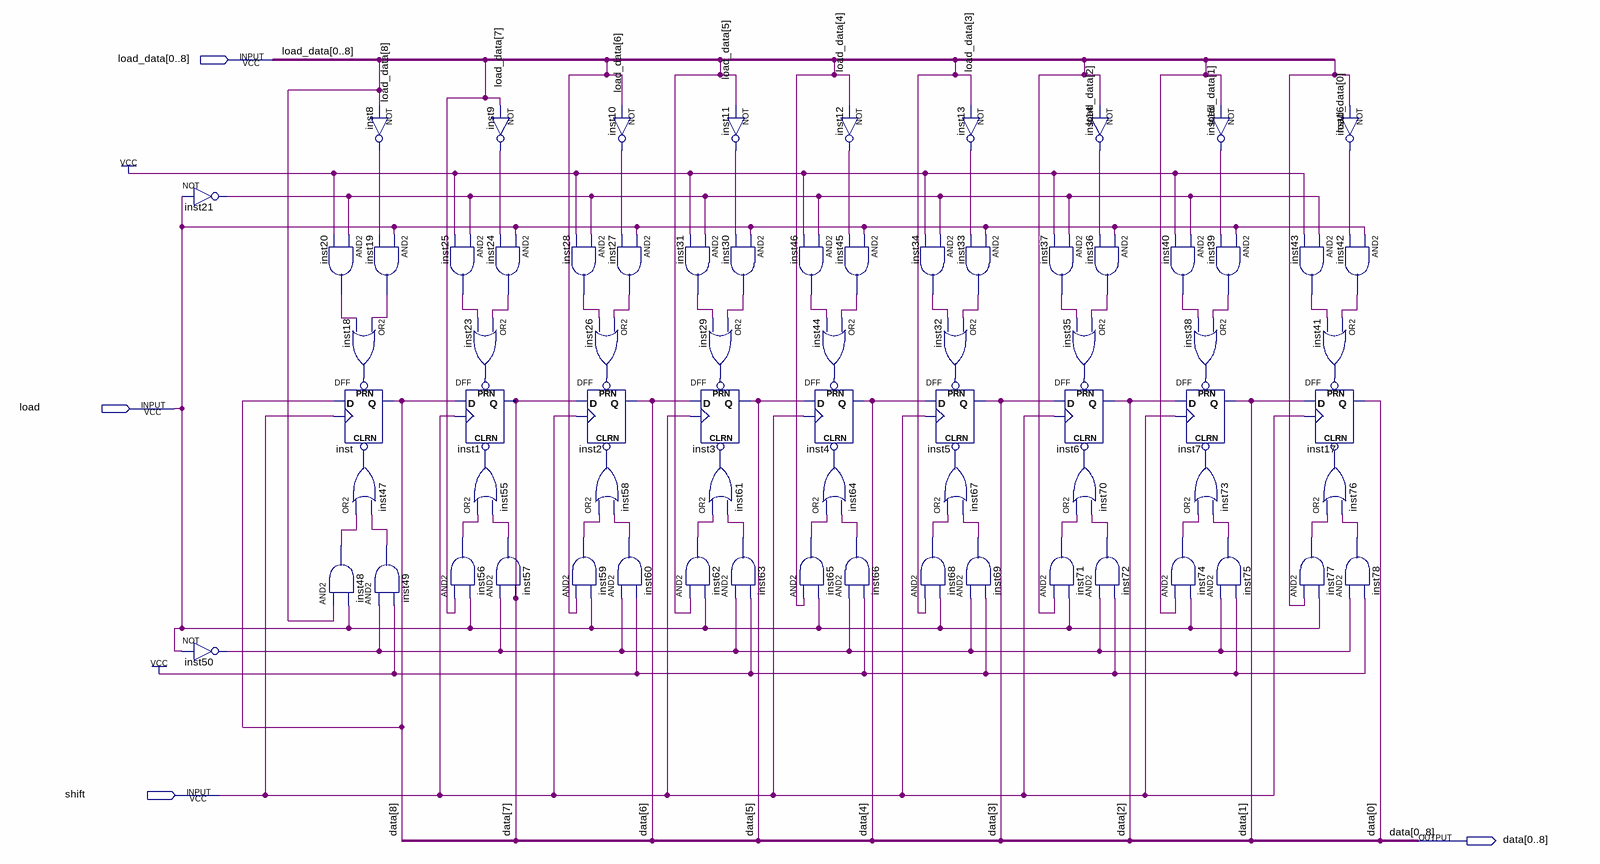
[diagram p0: schematic sheet]
// Quartus schematic p_register.bdf as structural Verilog: 74 symbols, 4 pins
module p_register (
  input  [0:8] load_data,
  input  load,
  input  shift,
  output [0:8] data
);

  wire inst8_out, inst9_out, inst10_out, inst11_out, inst12_out, inst13_out, inst14_out, inst15_out,
       inst16_out, inst18_out, inst19_out, inst20_out, inst21_out, inst23_out, inst24_out, inst25_out,
       inst26_out, inst27_out, inst28_out, inst29_out, inst30_out, inst31_out, inst32_out, inst33_out,
       inst34_out, inst35_out, inst36_out, inst37_out, inst38_out, inst39_out, inst40_out, inst41_out,
       inst42_out, inst43_out, inst44_out, inst45_out, inst46_out, inst47_out, inst48_out, inst49_out,
       inst50_out, inst55_out, inst56_out, inst57_out, inst58_out, inst59_out, inst60_out, inst61_out,
       inst62_out, inst63_out, inst64_out, inst65_out, inst66_out, inst67_out, inst68_out, inst69_out,
       inst70_out, inst71_out, inst72_out, inst73_out, inst74_out, inst75_out, inst76_out, inst77_out,
       inst78_out;

  not inst21 (inst21_out, load);
  not inst50 (inst50_out, load);
  not inst8 (inst8_out, load_data[8]);
  and inst19 (inst19_out, load, inst8_out);
  and inst20 (inst20_out, inst21_out, 1'b1);
  or inst18 (inst18_out, inst19_out, inst20_out);
  DFF inst (.CLRN(inst47_out), .CLK(shift), .D(data[8]), .PRN(inst18_out), .Q(data[8]));
  or inst47 (inst47_out, inst48_out, inst49_out);
  and inst48 (inst48_out, load_data[8], load);
  and inst49 (inst49_out, inst50_out, 1'b1);
  not inst9 (inst9_out, load_data[7]);
  and inst24 (inst24_out, load, inst9_out);
  and inst25 (inst25_out, inst21_out, 1'b1);
  or inst23 (inst23_out, inst24_out, inst25_out);
  DFF inst1 (.CLRN(inst55_out), .CLK(shift), .D(data[8]), .PRN(inst23_out), .Q(data[7]));
  or inst55 (inst55_out, inst56_out, inst57_out);
  and inst56 (inst56_out, load_data[7], load);
  and inst57 (inst57_out, inst50_out, data[7]);
  not inst10 (inst10_out, load_data[6]);
  and inst27 (inst27_out, load, inst10_out);
  and inst28 (inst28_out, inst21_out, 1'b1);
  or inst26 (inst26_out, inst27_out, inst28_out);
  DFF inst2 (.CLRN(inst58_out), .CLK(shift), .D(data[7]), .PRN(inst26_out), .Q(data[6]));
  or inst58 (inst58_out, inst59_out, inst60_out);
  and inst59 (inst59_out, load_data[6], load);
  and inst60 (inst60_out, inst50_out, 1'b1);
  not inst11 (inst11_out, load_data[5]);
  and inst30 (inst30_out, load, inst11_out);
  and inst31 (inst31_out, inst21_out, 1'b1);
  or inst29 (inst29_out, inst30_out, inst31_out);
  DFF inst3 (.CLRN(inst61_out), .CLK(shift), .D(data[6]), .PRN(inst29_out), .Q(data[5]));
  or inst61 (inst61_out, inst62_out, inst63_out);
  and inst62 (inst62_out, load_data[5], load);
  and inst63 (inst63_out, inst50_out, 1'b1);
  and inst46 (inst46_out, inst21_out, 1'b1);
  and inst65 (inst65_out, load_data[4], load);
  not inst12 (inst12_out, load_data[4]);
  and inst45 (inst45_out, load, inst12_out);
  or inst44 (inst44_out, inst45_out, inst46_out);
  DFF inst4 (.CLRN(inst64_out), .CLK(shift), .D(data[5]), .PRN(inst44_out), .Q(data[4]));
  or inst64 (inst64_out, inst65_out, inst66_out);
  and inst66 (inst66_out, inst50_out, 1'b1);
  and inst34 (inst34_out, inst21_out, 1'b1);
  and inst68 (inst68_out, load_data[3], load);
  not inst13 (inst13_out, load_data[3]);
  and inst33 (inst33_out, load, inst13_out);
  or inst32 (inst32_out, inst33_out, inst34_out);
  DFF inst5 (.CLRN(inst67_out), .CLK(shift), .D(data[4]), .PRN(inst32_out), .Q(data[3]));
  or inst67 (inst67_out, inst68_out, inst69_out);
  and inst69 (inst69_out, inst50_out, 1'b1);
  not inst14 (inst14_out, load_data[2]);
  and inst36 (inst36_out, load, inst14_out);
  and inst37 (inst37_out, inst21_out, 1'b1);
  or inst35 (inst35_out, inst36_out, inst37_out);
  DFF inst6 (.CLRN(inst70_out), .CLK(shift), .D(data[3]), .PRN(inst35_out), .Q(data[2]));
  or inst70 (inst70_out, inst71_out, inst72_out);
  and inst71 (inst71_out, load_data[2], load);
  and inst72 (inst72_out, inst50_out, 1'b1);
  not inst15 (inst15_out, load_data[1]);
  and inst39 (inst39_out, load, inst15_out);
  and inst40 (inst40_out, inst21_out, 1'b1);
  or inst38 (inst38_out, inst39_out, inst40_out);
  DFF inst7 (.CLRN(inst73_out), .CLK(shift), .D(data[2]), .PRN(inst38_out), .Q(data[1]));
  or inst73 (inst73_out, inst74_out, inst75_out);
  and inst74 (inst74_out, load_data[1], load);
  and inst75 (inst75_out, inst50_out, 1'b1);
  not inst16 (inst16_out, load_data[0]);
  and inst42 (inst42_out, load, inst16_out);
  and inst43 (inst43_out, inst21_out, 1'b1);
  or inst41 (inst41_out, inst42_out, inst43_out);
  DFF inst17 (.CLRN(inst76_out), .CLK(shift), .D(data[1]), .PRN(inst41_out), .Q(data[0]));
  or inst76 (inst76_out, inst77_out, inst78_out);
  and inst77 (inst77_out, load_data[0], load);
  and inst78 (inst78_out, inst50_out, 1'b1);
endmodule
